# Altium schematic sheet IMU.SchDoc
size A4
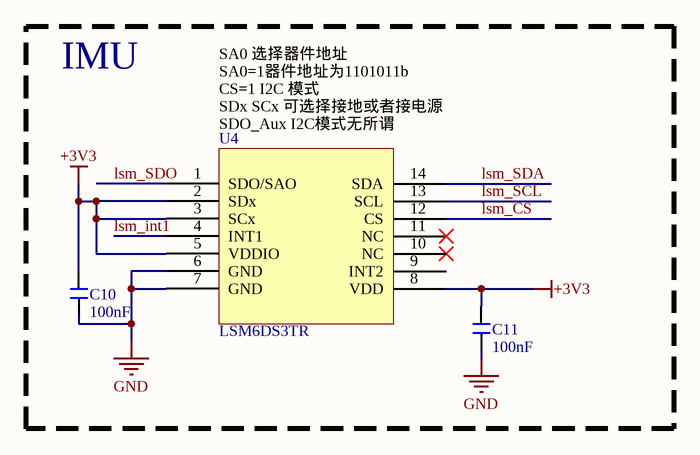
[diagram p0: IMU.SchDoc]

## Parts
C10  100nF  [C 0201_L]
C11  100nF  [C 0201_L]
U4  LSM6DS3TR  [LAG-14]

## Blocks framed on the sheet
IMU: C10 C11 U4

## Nets
+3V3: C10.2 C11.2 U4.2(SDx) U4.3(SCx) U4.5(VDDIO) U4.8(VDD)
GND: C10.1 C11.1 U4.6(GND) U4.7(GND)
lsm_CS: U4.12(CS)
lsm_int1: U4.4(INT1)
lsm_SCL: U4.13(SCL)
lsm_SDA: U4.14(SDA)
lsm_SDO: U4.1(SDO/SAO)

Not connected (* = marked no-connect by the designer): U4 9(INT2) 10(NC)* 11(NC)*

## Notes on the sheet
- (near U4) SA0 选择器件地址
  SA0=1器件地址为1101011b
  CS=1 I2C 模式
  SDx SCx 可选择接地或者接电源
  SDO_Aux I2C模式无所谓

## Library data of the parts
C10 C11 = C: 贴片电容; BOM名称: 无极性贴片电容; value: 100nF